# EasyEDA Pro project ProProject_commutation_hand.epro

# Schematic Schematic1
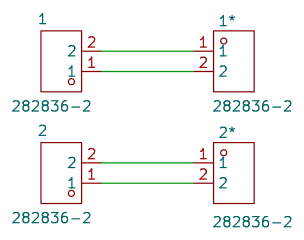
[diagram p0: schematic sheet]

## Parts
1  282836-2  [CONN-TH_2P-P5.00_282836-2]
1*  282836-2  [CONN-TH_2P-P5.00_282836-2]
2  282836-2  [CONN-TH_2P-P5.00_282836-2]
2*  282836-2  [CONN-TH_2P-P5.00_282836-2]

## Library data of the parts
1 = 282836-2: Pitch:5mm Color:Green Mounting Style:Direct Insert Current Rating (Max):13.5A Voltage Rating (Max):300V Number of Pins:2P Number of Rows:1 Wire Gauge - AWG:16~30 Wire Gauge - AWG:16~30 Number of PINs Per Row:2; LCSC Part Name: 5mm 排数:1 每排P数:2 直插; Supplier Part: C590402; Manufacturer: TE Connectivity(泰科电子); Supplier Footprint: 插件,P=5mm; JLCPCB Part Class: Extended Part; Datasheet: https://atta.szlcsc.com/upload/public/pdf/source/20240119/1DE6D9456CCE01F1F664469E3029A1B4.pdf; Supplier: LCSC; Pitch: 5mm; Color: Green; Mounting Style: Direct Insert; Current Rating (Max): 13.5A; Voltage Rating (Max): 300V; Number of Pins: 2P; Wire Gauge - AWG: 16~30; Number of PINs Per Row: 2
1* 2* = 282836-2: Pitch:5mm Color:Green Mounting Style:Direct Insert Current Rating (Max):13.5A Voltage Rating (Max):300V Number of Pins:2P Number of Rows:1 Wire Gauge - AWG:16~30 Wire Gauge - AWG:16~30 Number of PINs Per Row:2; LCSC Part Name: 5mm 排数:1 每排P数:2 直插; Supplier Part: C590402; Manufacturer: TE Connectivity(泰科电子); Supplier Footprint: 插件,P=5mm; JLCPCB Part Class: Extended Part; Datasheet: https://atta.szlcsc.com/upload/public/pdf/source/20240119/1DE6D9456CCE01F1F664469E3029A1B4.pdf; Supplier: LCSC; Pitch: 5mm; Color: Green; Mounting Style: Direct Insert; Current Rating (Max): 13.5A; Voltage Rating (Max): 300V; Number of Pins: 2P; Number of Rows: 1; Wire Gauge - AWG: 16~30; Number of PINs Per Row: 2
2 = 282836-2: Pitch:5mm Color:Green Mounting Style:Direct Insert Current Rating (Max):13.5A Voltage Rating (Max):300V Number of Pins:2P Number of Rows:1 Wire Gauge - AWG:16~30 Wire Gauge - AWG:16~30 Number of PINs Per Row:2; LCSC Part Name: 5mm 排数:1 每排P数:2 直插; Supplier Part: C590402; Manufacturer: TE Connectivity(泰科电子); Supplier Footprint: 插件,P=5mm; JLCPCB Part Class: Extended Part; Datasheet: https://atta.szlcsc.com/upload/public/pdf/source/20240119/1DE6D9456CCE01F1F664469E3029A1B4.pdf; Supplier: LCSC; Pitch: 5mm; Color: Green; Mounting Style: Direct Insert; Current Rating (Max): 13.5A; Voltage Rating (Max): 300V; Number of Pins: 2P; Number of Rows: 1; Wire Gauge - AWG: 16~30

## Nets
$1N239: 1.2 1*.1
$1N241: 1.1 1*.2
$1N243: 2.2 2*.1
$1N245: 2.1 2*.2

# Board PCB1
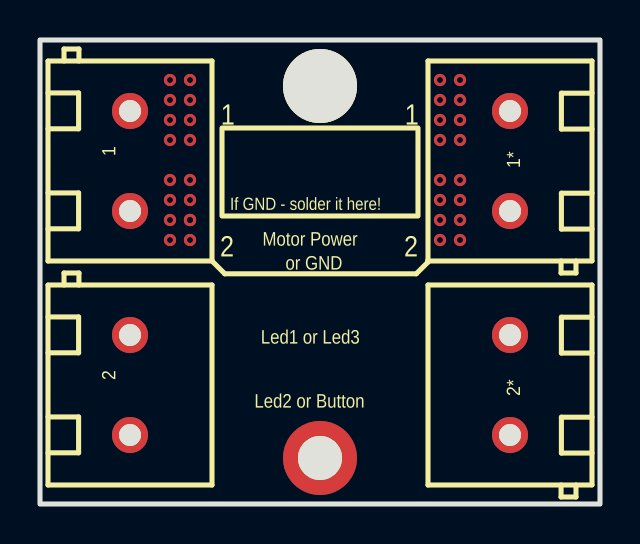
[diagram p1: board, top side]
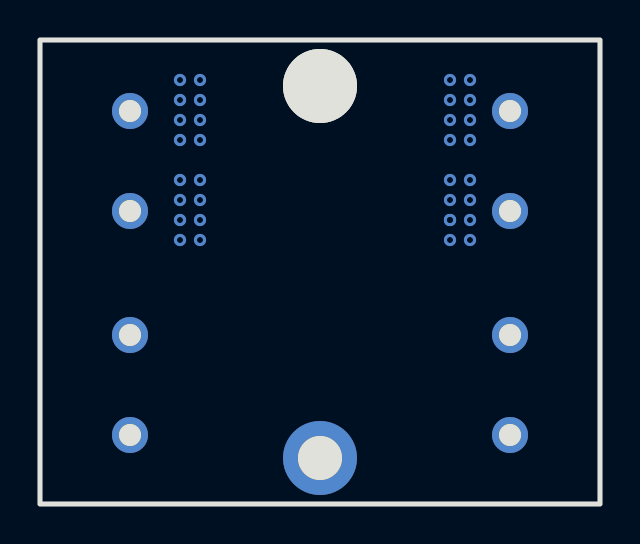
[diagram p2: board, bottom side, seen from below]

Outline 28 x 23.2 mm; copper layers: Top Layer, Bottom Layer. Coordinates in mm from the lower left corner of the outline.
Outline path: rectangle 0,23.2 28,0
Stack: Top Layer 0.035mm / Dielectric1 1.51mm FR4 er 4.5 / Bottom Layer 0.035mm

## Design rules (mm)
template: JLCPCB Capability(Two Layers Board)
spacing copperThickness1oz (default): track to track 0.102, other pairs 0.152 to 0.3
spacing copperThickness2oz: track to track 0.203, other pairs 0.152 to 0.3
track width copperThickness1oz (default): min 0.127, default 0.254, max 2.54
track width copperThickness2oz: min 0.203, default 0.254, max 2.54
differential pair differentialPair (default): width min 0.127, default 0.254, max 2.54; gap min 0.152, default 0.152
via viaSize (default): diameter min 0.5, default 0.61, max 10; hole min 0.3, default 0.305, max 6.3

## Placement (name value [footprint] x y rotation side)
1  282836-2  [conn-th_2p-p5.00_282836-2]  4.5 17.15 270 top
1*  282836-2  [conn-th_2p-p5.00_282836-2]  23.5 17.15 90 top
2  282836-2  [CONN-TH_2P-P5.00_282836-2]  4.5 5.95 270 top
2*  282836-2  [CONN-TH_2P-P5.00_282836-2]  23.5 5.95 90 top
NOREF  -  [Pad_e50]  14 2.3 0 top
NOREF#2  -  [Pad_e9]  14 20.9 0 top

## Footprints (pads in the part's own frame, mm; a bottom-side part is the same pattern mirrored in y, then rotated)
CONN-TH_2P-P5.00_282836-2
  round 1.8 hole 1.1: 1(-2.5,0) 2(2.5,0)
conn-th_2p-p5.00_282836-2
  round 1.8 hole 1.1: 1(-2.5,0) 2(2.5,0)
Pad_e9
  round 3.7 hole 3.7x2.2: 3(0,0)
Pad_e50
  round 3.7 hole 2.2: 3(0,0)

## Nets
$1N239: 1.2 1*.1
$1N241: 1.1 1*.2 NOREF#2.3
$1N243: 2.2 2*.1
$1N245: 2.1 2*.2

Pads without a net: NOREF 3

## Via types
v1: diameter 0.61, hole 0.305, Top Layer to Bottom Layer, 33 vias

## Routing (per net, layer and track width the routed paths; a pad name or vN(x,y) marks a point on that pad's centre or on a via; arc(x,y) is an arc through that point)
$1N239:
  vias: v1(6.5,16.2) v1(6.5,15.2) v1(6.5,14.2) v1(6.5,13.2) v1(7.5,16.2) v1(7.5,15.2) v1(7.5,14.2) v1(7.5,14.2) v1(7.5,13.2) v1(20,16.2) v1(20,15.2) v1(20,14.2) v1(20,13.2) v1(21,16.2) v1(21,15.2) v1(21,14.2) v1(21,13.2)
$1N241:
  vias: v1(6.5,21.2) v1(6.5,20.2) v1(6.5,19.2) v1(6.5,18.2) v1(7.5,21.2) v1(7.5,20.2) v1(7.5,19.2) v1(7.5,18.2) v1(20,21.2) v1(20,20.2) v1(20,19.2) v1(20,18.2) v1(21,21.2) v1(21,20.2) v1(21,19.2) v1(21,18.2)

## Copper pours and planes (outline as drawn; the poured copper is in the pictures)
$1N239 on Top Layer: 0,16.89 28,16.89 28,11.41 0,11.41
$1N239 on Bottom Layer: 0,16.89 28,16.89 28,11.41 0,11.41
$1N241 on Top Layer: 0,23.2 28,23.2 28,17.42 0,17.42
$1N241 on Bottom Layer: 0.1,23.19 28.1,23.19 28.1,17.41 0.1,17.41
$1N243 on Top Layer: 0,5.83 28,5.83 28,-0.03 0,-0.03
$1N243 on Bottom Layer: 0,5.83 28,5.83 28,-0.03 0,-0.03
$1N245 on Top Layer: 0,10.56 28,10.56 28,6.3 0,6.3

## Text on the board
Top Silkscreen Layer: If GND - solder it here! | Led2 or Button | Led1 or Led3 | Motor Power | or GND | 2 | 1
